# Altium schematic sheet Reference.SchDoc
size A4; CompanyName: Technische Hochschule Nürnberg Georg Simon Ohm; Organization: UltraZohm; Address1: Kesslerplatz 12; Address2: 90489 Nürnberg; Address3: GERMANY; SheetNumber: 4; SheetTotal: 9; Website: www.ultrazohm.com
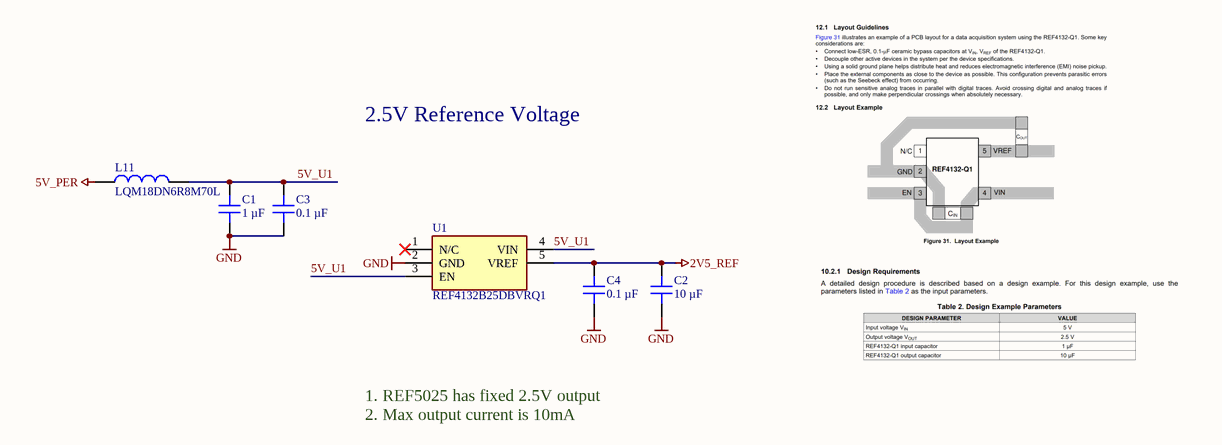
[diagram p0: Reference.SchDoc]

## Parts
C1  1 µF  [C_0603]
C2  10 µF  [C_1210_N]
C3  0.1 µF  [C_0603]
C4  0.1 µF  [C_0603]
L11  LQM18DN6R8M70L  [INDC1608X95N]
U1  REF4132B25DBVRQ1  [SOT95P280X145-5N]

## Nets
2V5_REF: C2.2 C4.2 U1.5(VREF)
5V_PER: L11.1
GND: C1.1 C2.1 C3.1 C4.1 U1.2(GND)
5V_U1: C1.2 C3.2 L11.2 U1.3(EN) U1.4(VIN)

Not connected (* = marked no-connect by the designer): U1 1(N/C)*

## Notes on the sheet
- 2.5V Reference Voltage
- 1. REF5025 has fixed 2.5V output
  2. Max output current is 10mA
- Title
- Revision:
- Design Engineer:
- Date:
- Project:
- Sheet
- of

## Library data of the parts
C1 = C0603C105K3RAC7411: Capacitor 0603, 25 VDC, 1 µF, X7R; Manufacturer: KEMET; Tolerance: 10 %; Voltage Rating: 25 VDC; Created from: MGremer; Manufacturer Part Number: C0603C105K3RAC7411; PartID: 4; Created On: 20.12.2020 13:54:13; ComponentLink1Description: Datasheet; ComponentLink1URL: https://www.mouser.de/datasheet/2/212/KEM_C1002_X7R_SMD-1102033.pdf; Component Type: Capacitor 0603; Device Package: 0603; Last Updated: 20.12.2020 16:43:05; Mounting Type: SMD; Operating Temperature: -55 - 125°C; Series: SMD Comm X7R; Supplier 1: Mouser; Supplier Part Number 1: 80-C0603C105K3RLR; Type: Capacitor; Value: 1 µF; Live Cycle Status: 1; Stock number: Labor SMD Container
C2 = GRM32EC72A106KE05L: Capacitor 1210, 100 VDC, 10µF, X7S; Manufacturer: Murata Electronics; Tolerance: 10 %; Voltage Rating: 100 VDC; Created from: DHufnagel; Manufacturer Part Number: GRM32EC72A106KE05L; PartID: 118; Created On: 21.12.2022 14:25:08; ComponentLink1Description: Datasheet; ComponentLink1URL: https://www.mouser.de/datasheet/2/281/1/GRM32EC72A106KE05_01A-1988109.pdf; Component Type: Capacitor 1210; Device Package: 1210; Last Updated: 21.12.2022 14:25:08; Mounting Type: SMD; Operating Temperature: -55 - 125°C; Series: GRM; Supplier 1: Mouser; Supplier Part Number 1: 81-GRM32EC72A106KE05; Type: Capacitor; Value: 10 µF; Live Cycle Status: 1; Stock number: not stored
C3 C4 = C1608X7S2A104K080AB: Capacitor 0603, 100 VDC, 0.1 uF, X7S; Manufacturer: TDK; Tolerance: 10 %; Voltage Rating: 100 VDC; Created from: DHufnagel; Manufacturer Part Number: C1608X7S2A104K080AB; PartID: 112; Created On: 20.12.2020 13:54:13; ComponentLink1Description: Datasheet; ComponentLink1URL: https://product.tdk.com/system/files/dam/doc/product/capacitor/ceramic/mlcc/catalog/mlcc_commercial_midvoltage_en.pdf?ref_disty=mouser; Component Type: Capacitor 0603; Device Package: 0603; Last Updated: 14.12.2022 12:14:21; Mounting Type: SMD; Operating Temperature: -55 - 125°C; Series: C; Supplier 1: Mouser; Supplier Part Number 1: 810-C1608X7S2A104K; Type: Capacitor; Value: 0.1 µF; Live Cycle Status: 1; Stock number: not stored
L11 = LQM18DN6R8M70L: 6.8µH, 120mA, 0603, 740mOhm, 20%; Manufacturer: Murata; MF: EPCOS / TDK; Value: 6.8uH; DCR: 320m; Rated Current: 0.85 A; Type: fixed inductor; Created from: DHufnagel; MPN: B82464G4154M; Supplier 1: Mouser; Supplier Part Number 1: 81-LQM18DN6R8M70L; Manufacturer Part Number: LQM18DN6R8M70L; PartID: 10; Created On: 19.07.2022 15:47:17; ComponentLink1Description: Datasheet; ComponentLink1URL: https://www.mouser.de/datasheet/2/281/1/JELF243B_0086-2298241.pdf; Component Type: SMD fixed inductor; Device Package: SMD; Last Updated: 19.07.2022 15:47:44; Mounting Type: SMD; Operating Temperature: -40 - 125°C; Series: LQM18DN_70; Supplier 2: Digi-Key; Supplier Part Number 2: 490-LQM18DN6R8M70LCT-ND; DC current: 120mA; Live Cycle Status: 1; Stock number: not stored
U1 = REF4132B25DBVRQ1: Voltage Reference, 2.5V, ±0.05%, ±10mA; Manufacturer: Texas Instruments; Created from: DHufnagel; Manufacturer Part Number: REF4132B25DBVRQ1; PartID: 10; Created On: 08.07.2022 12:48:56; ComponentLink1Description: Datasheet; ComponentLink1URL: https://www.ti.com/general/docs/suppproductinfo.tsp?distId=26&gotoUrl=https://www.ti.com/lit/gpn/ref4132-q1; Component Type: Voltage Reference; Device Package: SMD; Last Updated: 08.07.2022 12:59:37; Mounting Type: SMD; Operating Temperature: -40 - 125 °C; Series: -40 - 125 °C; Supplier 1: Mouser; Supplier Part Number 1: 595-REF4132B25DBVRQ1; Supplier 2: Digi-Key; Supplier Part Number 2: 296-REF4132B25DBVRQ1CT-ND; Type: Voltage Reference; Value: 2.5 V; Live Cycle Status: 1; Stock number: not stored